# EAGLE schematic leds_et_motor (EAGLE 6.5.0)
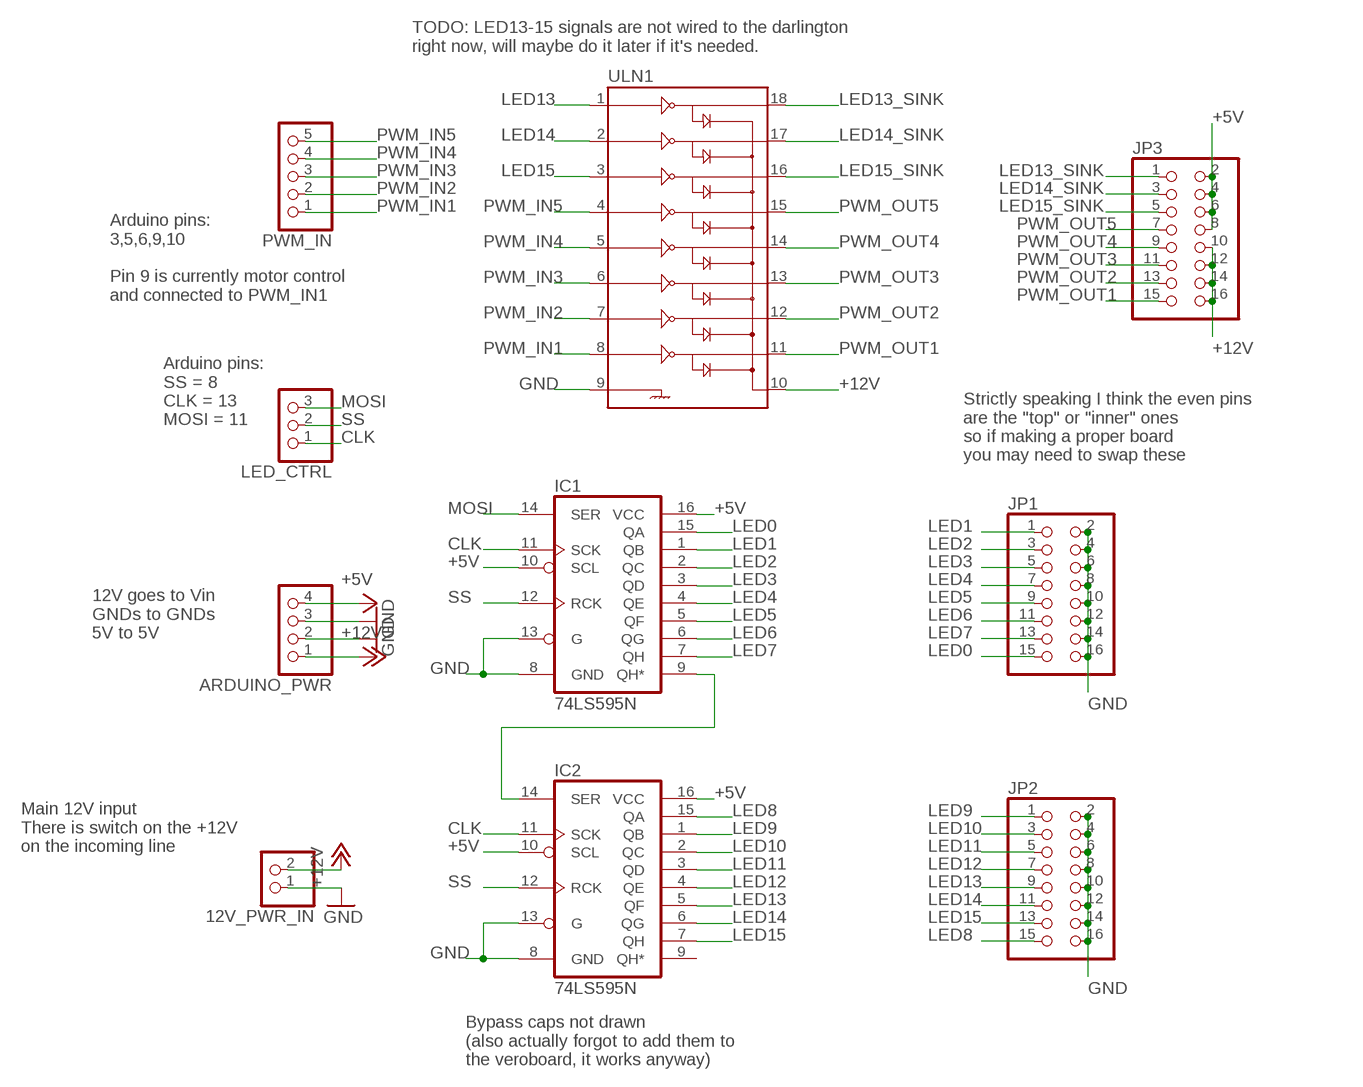
[diagram p0: schematic, sheet 1]

## Parts
12V_PWR_IN  PINHD-1X2  [1X02]
ARDUINO_PWR  PINHD-1X4  [1X04]
IC1  74LS595N  [DIL16]
IC2  74LS595N  [DIL16]
JP1  PINHD-2X8/90  [2X08/90]
JP2  PINHD-2X8/90  [2X08/90]
JP3  PINHD-2X8/90  [2X08/90]
LED_CTRL  PINHD-1X3  [1X03]
PWM_IN  PINHD-1X5  [1X05]
ULN1  ULN2803DIP  [DIL18]

## Nets
+5V: ARDUINO_PWR.4 IC1.10(SCL) IC1.16(VCC) IC2.10(SCL) IC2.16(VCC) JP3.2 JP3.4 JP3.6 JP3.8
+12V: 12V_PWR_IN.2 ARDUINO_PWR.1 JP3.10 JP3.12 JP3.14 JP3.16 ULN1.10
CHAIN0: IC1.9(QH*) IC2.14(SER)
CLK: IC1.11(SCK) IC2.11(SCK) LED_CTRL.1
GND: 12V_PWR_IN.1 ARDUINO_PWR.2 ARDUINO_PWR.3 IC1.8(GND) IC1.13(G) IC2.8(GND) IC2.13(G) JP1.2 JP1.4 JP1.6 JP1.8 JP1.10 JP1.12 JP1.14 JP1.16 JP2.2 JP2.4 JP2.6 JP2.8 JP2.10 JP2.12 JP2.14 JP2.16 ULN1.9
LED0: IC1.15(QA) JP1.15
LED1: IC1.1(QB) JP1.1
LED2: IC1.2(QC) JP1.3
LED3: IC1.3(QD) JP1.5
LED4: IC1.4(QE) JP1.7
LED5: IC1.5(QF) JP1.9
LED6: IC1.6(QG) JP1.11
LED7: IC1.7(QH) JP1.13
LED8: IC2.15(QA) JP2.15
LED9: IC2.1(QB) JP2.1
LED10: IC2.2(QC) JP2.3
LED11: IC2.3(QD) JP2.5
LED12: IC2.4(QE) JP2.7
LED13: IC2.5(QF) JP2.9 ULN1.1
LED13_SINK: JP3.1 ULN1.18
LED14: IC2.6(QG) JP2.11 ULN1.2
LED14_SINK: JP3.3 ULN1.17
LED15: IC2.7(QH) JP2.13 ULN1.3
LED15_SINK: JP3.5 ULN1.16
MOSI: IC1.14(SER) LED_CTRL.3
PWM_IN1: PWM_IN.1 ULN1.8
PWM_IN2: PWM_IN.2 ULN1.7
PWM_IN3: PWM_IN.3 ULN1.6
PWM_IN4: PWM_IN.4 ULN1.5
PWM_IN5: PWM_IN.5 ULN1.4
PWM_OUT1: JP3.15 ULN1.11
PWM_OUT2: JP3.13 ULN1.12
PWM_OUT3: JP3.11 ULN1.13
PWM_OUT4: JP3.9 ULN1.14
PWM_OUT5: JP3.7 ULN1.15
SS: IC1.12(RCK) IC2.12(RCK) LED_CTRL.2
Unconnected: IC2.9(QH*)

## Notes on the sheet
- TODO: LED13-15 signals are not wired to the darlington
  right now, will maybe do it later if it's needed.
- Arduino pins:
  3,5,6,9,10
  
  Pin 9 is currently motor control 
  and connected to PWM_IN1
- Arduino pins:
  SS = 8
  CLK = 13
  MOSI = 11
- Strictly speaking I think the even pins
  are the "top" or "inner" ones
  so if making a proper board 
  you may need to swap these
- 12V goes to Vin
  GNDs to GNDs
  5V to 5V
- Main 12V input
  There is switch on the +12V
  on the incoming line
- Bypass caps not drawn
  (also actually forgot to add them to
  the veroboard, it works anyway)

## Library data of the parts
12V_PWR_IN = pinhead:PINHD-1X2: PIN HEADER
ARDUINO_PWR = pinhead:PINHD-1X4: PIN HEADER
IC1 IC2 = SparkFun-DigitalIC:74*595: 8-bit SHIFT REGISTER, output latch
JP1-JP3 = pinhead:PINHD-2X8: PIN HEADER
LED_CTRL = pinhead:PINHD-1X3: PIN HEADER
PWM_IN = pinhead:PINHD-1X5: PIN HEADER
ULN1 = SparkFun-PowerIC:ULN2803: Darlington Driver ULN2803 Darlington array. 500mA max per channel, 8-channel package. Spark Fun Electronics SKU : COM-00312